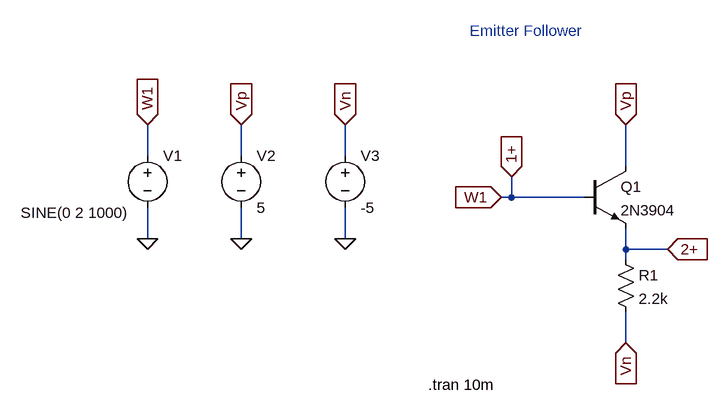
[diagram p0: schematic emit_flw_ltspice.asc]
emit_flw_ltspice.asc, the LTspice schematic file:
Version 4
SHEET 1 880 680
WIRE -592 -16 -592 -64
WIRE -448 -16 -448 -64
WIRE -288 -16 -288 -64
WIRE 144 0 144 -64
WIRE -32 48 -32 16
WIRE -32 48 -48 48
WIRE 80 48 -32 48
WIRE -592 112 -592 64
WIRE -448 112 -448 64
WIRE -288 112 -288 64
WIRE 144 128 144 96
WIRE 208 128 144 128
WIRE 144 144 144 128
WIRE 144 272 144 224
FLAG -48 48 W1
IOPIN -48 48 In
FLAG 144 -64 Vp
IOPIN 144 -64 In
FLAG 144 272 Vn
IOPIN 144 272 In
FLAG -592 112 0
FLAG -448 112 0
FLAG -288 112 0
FLAG -592 -64 W1
IOPIN -592 -64 In
FLAG -448 -64 Vp
IOPIN -448 -64 In
FLAG -288 -64 Vn
IOPIN -288 -64 In
FLAG -32 16 1+
IOPIN -32 16 In
FLAG 208 128 2+
IOPIN 208 128 In
SYMBOL npn 80 0 R0
SYMATTR InstName Q1
SYMATTR Value 2N3904
SYMBOL res 128 128 R0
SYMATTR InstName R1
SYMATTR Value 2.2k
SYMBOL voltage -592 -32 R0
WINDOW 3 -195 104 Left 2
WINDOW 123 0 0 Left 0
WINDOW 39 0 0 Left 0
SYMATTR Value SINE(0 2 1000)
SYMATTR InstName V1
SYMBOL voltage -448 -32 R0
WINDOW 123 0 0 Left 0
WINDOW 39 0 0 Left 0
SYMATTR InstName V2
SYMATTR Value 5
SYMBOL voltage -288 -32 R0
WINDOW 123 0 0 Left 0
WINDOW 39 0 0 Left 0
SYMATTR InstName V3
SYMATTR Value -5
TEXT -160 336 Left 2 !.tran 10m
TEXT -96 -208 Left 2 ;Emitter Follower

The netlist it stands for:
* emit_flw_ltspice.asc
Q1 Vp 1+ 2+ 0 2N3904
R1 2+ Vn 2.2k
V1 1+ 0 SINE(0 2 1000)
V2 Vp 0 5
V3 Vn 0 -5
.model NPN NPN
.model PNP PNP
.lib standard.bjt
.tran 10m
* Emitter Follower
.backanno
.end